# EAGLE design ATiny2PiRM12B-SMD (EAGLE 7.2.0)
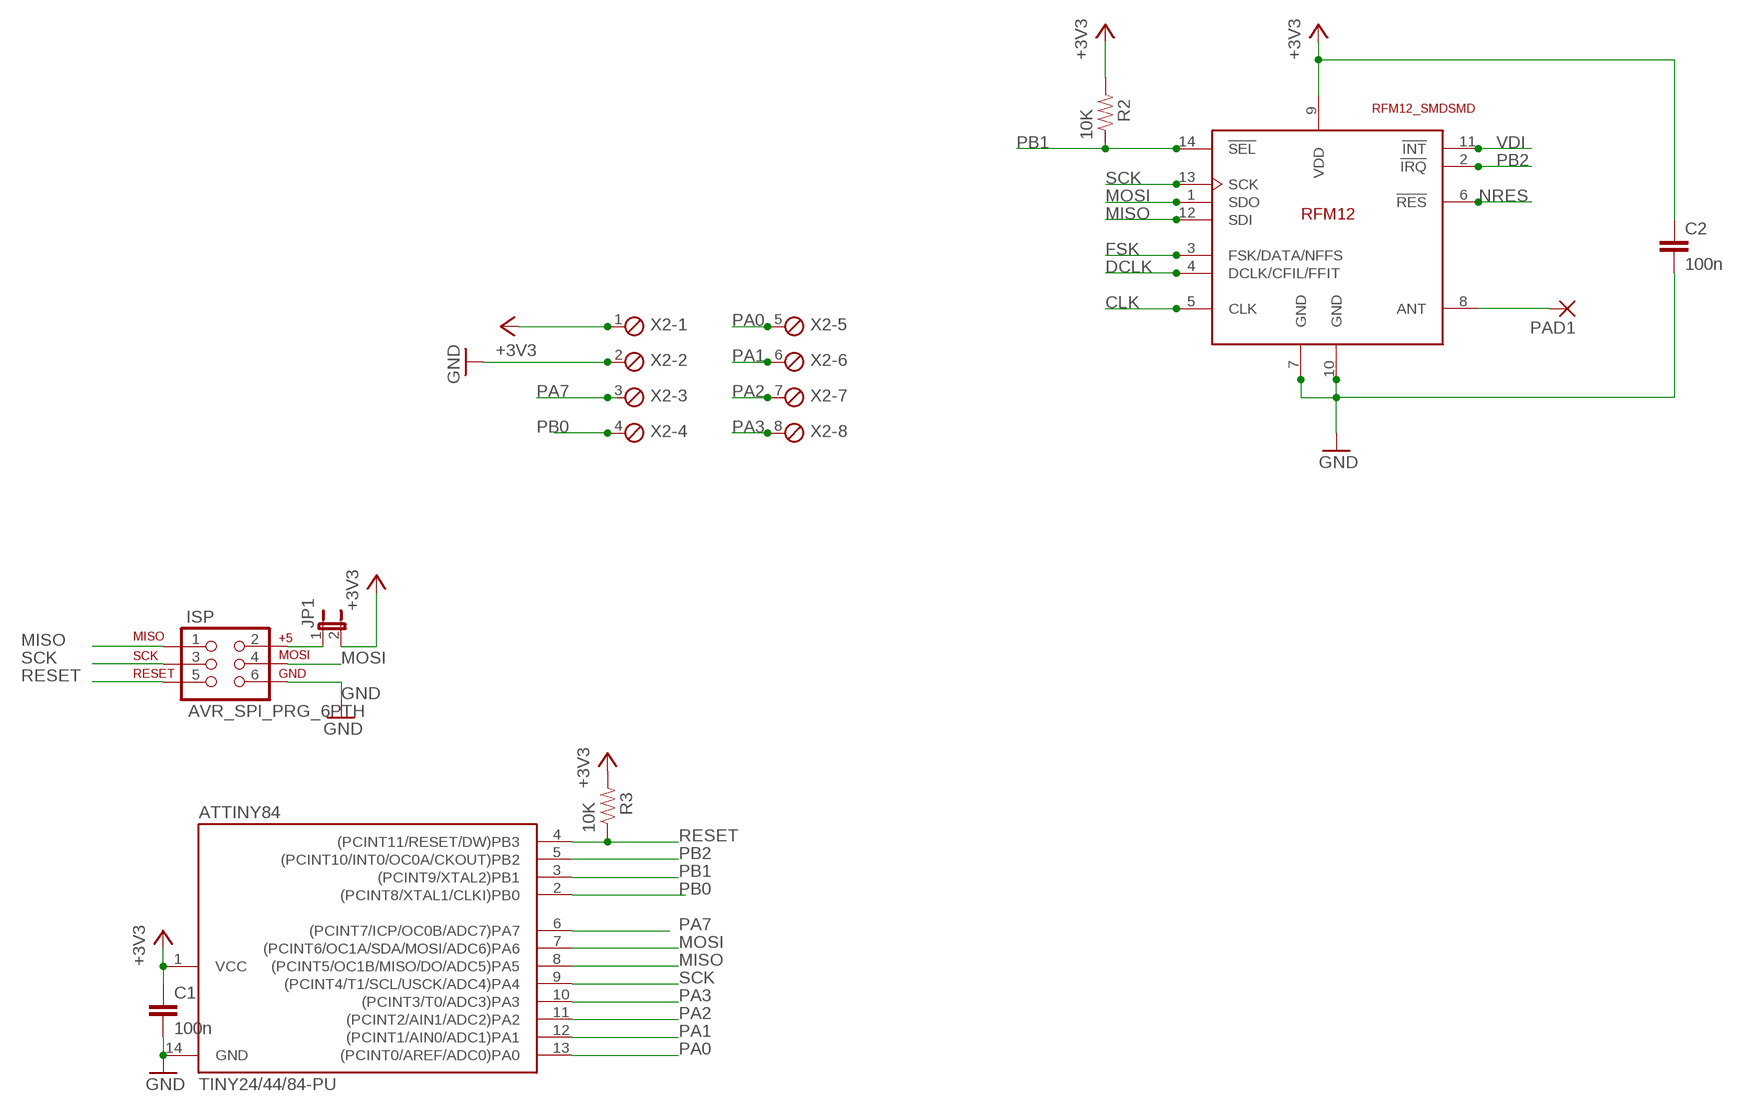
[diagram p0: schematic, sheet 1]

## Parts
ATTINY84  TINY24/44/84-PU  [DIL14]
C1  100n  C-EU025-024X044  [C025-024X044]
C2  100n  C-EU025-024X044  [C025-024X044]
ISP  AVR_SPI_PRG_6PTH  [2X3]
JP1  JUMPER-2PTH  [1X02]
PAD1  1,6/0,8  [1,6/0,8]
R2  10K  RESISTORAXIAL-0.3  [AXIAL-0.3]
R3  10K  RESISTORAXIAL-0.3  [AXIAL-0.3]
U$2  RFM12_SMDSMD  [RFM12]
X2  MPT8  [8POL254]

## Nets
+3V3 [power]: ATTINY84.1(VCC) C1.1 JP1.2 R2.P$2 R3.P$2 X2.1
CLK: U$2.5(CLK)
DCLK: U$2.4(DCLK/CFIL/FFIT)
FSK: U$2.3(FSK/DATA/NFFS)
GND [power]: ATTINY84.14(GND) C1.2 C2.2 ISP.6 U$2.7(GND) U$2.10(GND) X2.2
MISO: ATTINY84.8((PCINT5/OC1B/MISO/DO/ADC5)PA5) ISP.1 U$2.12(SDI)
MOSI: ATTINY84.7((PCINT6/OC1A/SDA/MOSI/ADC6)PA6) ISP.4 U$2.1(SDO)
N$1: ISP.2 JP1.1
N$2: PAD1.1(P) U$2.8(ANT)
NRES: U$2.6(!RES)
PA0: ATTINY84.13((PCINT0/AREF/ADC0)PA0) X2.5
PA1 [power]: ATTINY84.12((PCINT1/AIN0/ADC1)PA1) X2.6
PA2: ATTINY84.11((PCINT2/AIN1/ADC2)PA2) X2.7
PA3: ATTINY84.10((PCINT3/T0/ADC3)PA3) X2.8
PA7: ATTINY84.6((PCINT7/ICP/OC0B/ADC7)PA7) X2.3
PB0: ATTINY84.2((PCINT8/XTAL1/CLKI)PB0) X2.4
PB1: ATTINY84.3((PCINT9/XTAL2)PB1) R2.P$1 U$2.14(!SEL)
PB2: ATTINY84.5((PCINT10/INT0/OC0A/CKOUT)PB2) U$2.2(!IRQ)
RESET: ATTINY84.4((PCINT11/RESET/DW)PB3) ISP.5 R3.P$1
SCK: ATTINY84.9((PCINT4/T1/SCL/USCK/ADC4)PA4) ISP.3 U$2.13(SCK)
VDD [power]: C2.1 U$2.9(VDD) ; supply symbol labelled +3V3
VDI: U$2.11(!INT)

## Library data of the parts
ATTINY84 = avr-7:TINY24/44/84
C1 C2 = rcl:C-EU: CAPACITOR, European symbol
ISP = SparkFun:AVR_SPI_PRG_6: AVR ISP 6 Pin This is the reduced ISP connector for AVR programming. Common on Arduino. This footprint will take up less PCB space and can be used with a 10-pin to 6-pin adapter such as SKU: BOB-08508
JP1 = SparkFun:JUMPER-2: Jumper Basic 0.1" spaced jumper. Use with breakaway headers.
PAD1 = wirepad:1,6/0,8: THROUGH-HOLE PAD
R2 R3 = SparkFun:RESISTOR: Resistor Basic schematic elements and footprints for 0603, 1206, and PTH resistors.
U$2 = rfm_12:RFM12_SMD: RFM12 is a low costing ISM band transceiver module implemented with unique PLL. It works signal ranges from 315/433/868/915MHZ bands, comply with FCC, ETSI regulation. The SPI interface is used to communicate with microcontroller for parameter setting.
X2 = con-phoenix-254:MPT8: PHOENIX CONNECTOR; OC_FARNELL: unknown; OC_NEWARK: unknown

## Net classes
0 default: width 0.254 mm, drill 0.254 mm, clearance 0.254 mm
1 power: width 0.305 mm, drill 0.305 mm, clearance 0.305 mm

## Board
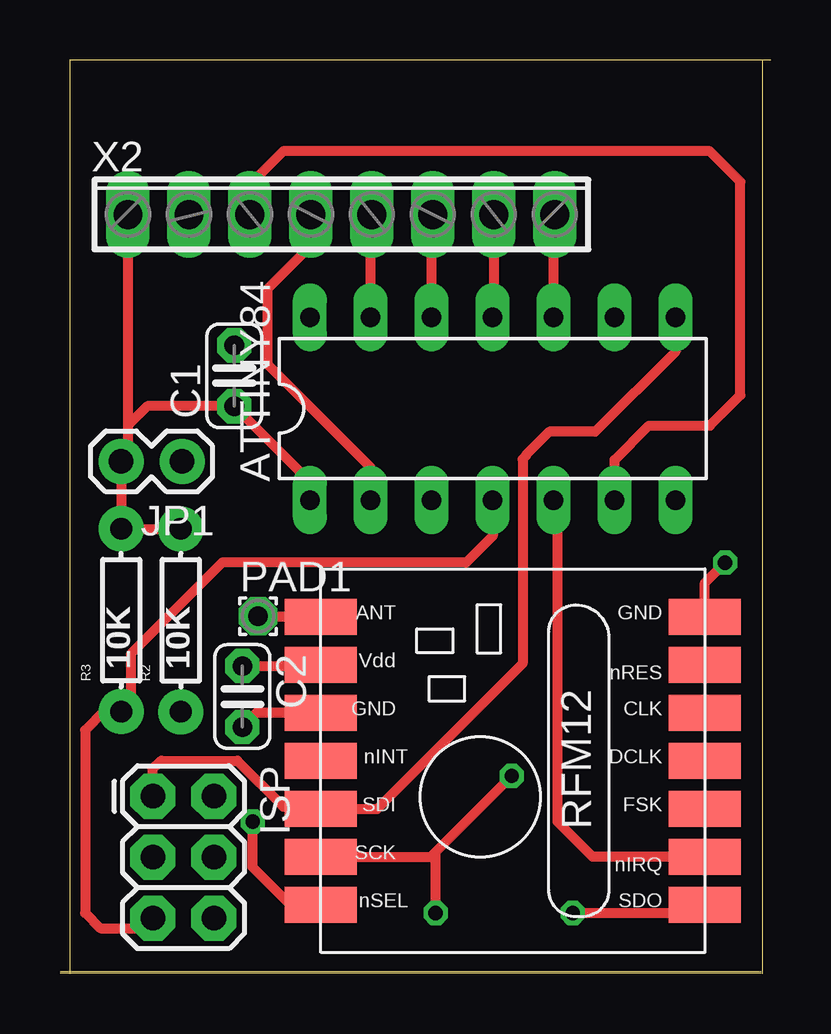
[diagram p1: board, top side]
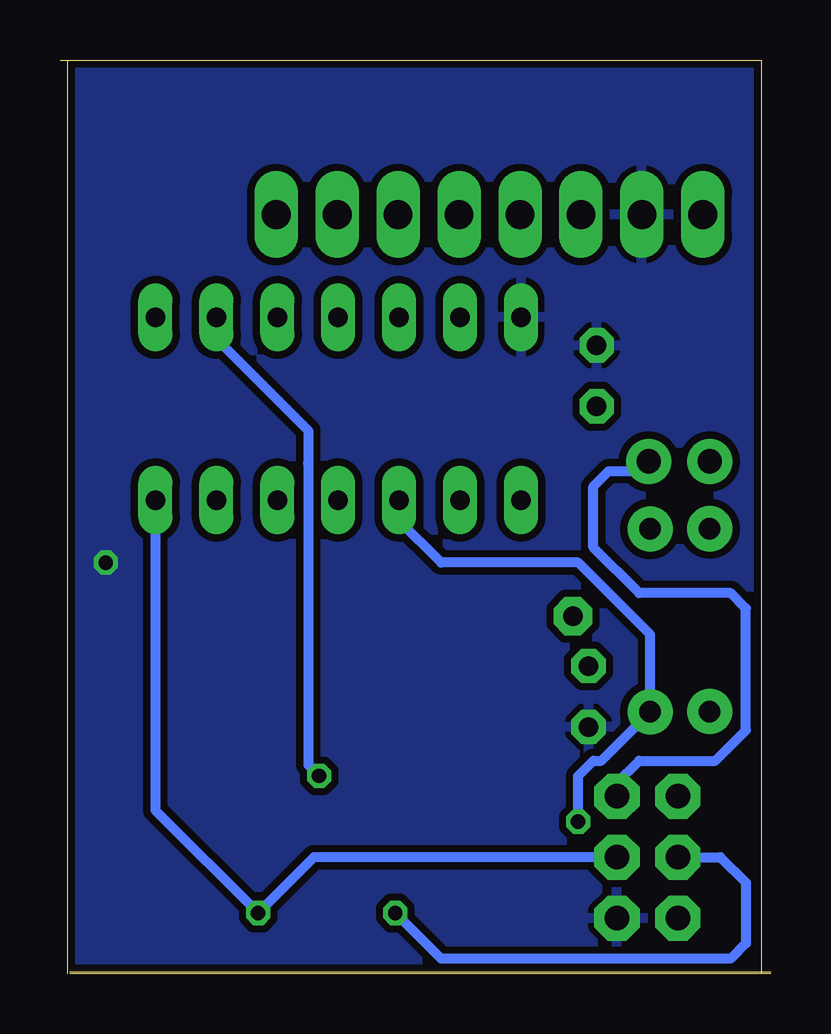
[diagram p2: board, bottom side, seen from below]

Size 29.62 x 38.1 mm. Coordinates in mm from the lower left corner, seen from the top.
Outline: 29.29,0 29.29,38.09
Outline: 0.41,0 0.41,38.1 29.62,38.1
Outline: 29.21,0.1 0,0.1
Outline: 29.21,0.02 0,0.02
Copper layers (1*16): Top 0.035mm / dielectric 1.5mm / Bottom 0.035mm
Design rules "default": minimum track width 12mil, minimum drill 24mil, track to track 12mil, track to pad 12mil, pad to pad 12mil, via to via 14mil, smd to smd 10mil, copper to edge 12mil, drill to drill 8mil, minimum pad ring 12mil, minimum via ring 8mil, stop-mask expansion 4mil, vias tented up to drill 0mil, thermal gap 10mil

### Footprints (pad centres in the part's own frame; a part is rotated, then mirrored left to right if it is on the bottom)
DIL14 = drill 0.813 long: 1 -7.62,-3.81; 2 -5.08,-3.81; 3 -2.54,-3.81; 4 0,-3.81; 5 2.54,-3.81; 6 5.08,-3.81; 7 7.62,-3.81; 8 7.62,3.81; 9 5.08,3.81; 10 2.54,3.81; 11 0,3.81; 12 -2.54,3.81; 13 -5.08,3.81; 14 -7.62,3.81
C025-024X044 = drill 0.813 octagon: 1 -1.27,0; 2 1.27,0
2X3 = drill 1.016 pad 1.88 octagon: 1 0,0; 2 0,2.54; 3 2.54,0; 4 2.54,2.54; 5 5.08,0; 6 5.08,2.54
1X02 = drill 1.016 pad 1.88: 1 0,0; 2 2.54,0
1,6/0,8 = drill 0.813 pad 1.6 octagon: 1 0,0
AXIAL-0.3 = drill 0.9 pad 1.88: P$1 -3.81,0; P$2 3.81,0
RFM12 = smd 1.5 x 3: 1 -5,-10; 2 -3,-10; 3 -1,-10; 4 1,-10; 5 3,-10; 6 5,-10; 7 7,-10; 8 7,6; 9 5,6; 10 3,6; 11 1,6; 12 -1,6; 13 -3,6; 14 -5,6
8POL254 = drill 1.2 long: 1 -8.89,0; 2 -6.35,0; 3 -3.81,0; 4 -1.27,0; 5 1.27,0; 6 3.81,0; 7 6.35,0; 8 8.89,0

### Placement (x,y rotation side)
ATTINY84  18.03,23.57 0 top
C1  7.26,24.93 90 top
C2  7.6,11.57 270 top
ISP  3.87,7.41 270 top
JP1  5.09,21.36 180 top
PAD1  8.25,14.91 0 top
R2  5.03,14.74 90 top
R3  2.55,14.75 90 top
U$2  16.87,7.88 90 top
X2  11.72,31.66 0 top

### Tracks (layer width: path | path; a pad name or v marks a point on that pad's centre or on a via)
+3V3
  Top 0.406: ATTINY84.1 10.01,19.76 10.01,20.92 C1.1 3.64,23.66 2.83,22.86 | 5.17,18.41 R2.P$2 R3.P$2 JP1.2 2.83,21.65 2.83,22.86 | X2.1 2.83,22.86
GND  (via drill 0.6)
  Top 0.406: U$2.10 8.18,10.88 C2.2 | U$2.7 26.87,16.3 v27.71,17.14
  pour Bottom: 0.41,38.1 29.62,38.1 29.62,0 0.41,0
MISO
  Top 0.406: ISP.1 3.87,8.54 4.22,8.89 7.39,8.89 9.3,6.99 10.77,6.99 U$2.12 10.89,6.86 13.2,6.86 19.27,12.94 19.27,21.45 19.41,21.59 19.41,21.62 20.4,22.6 22.3,22.6 25.65,25.95 ATTINY84.8
MOSI  (via drill 0.6)
  Top 0.406: v21.36,2.54 26.53,2.54 U$2.1
  Bottom 0.406: ISP.4 19.04,4.87 v21.36,2.54 25.65,6.82 ATTINY84.7
N$1
  Bottom 0.406: ISP.2 6.41,7.97 5.49,8.89 2.31,8.89 1.04,10.16 1.04,15.24 1.68,15.88 5.49,15.88 7.39,17.78 7.39,20.32 6.76,20.95 5.5,20.95 JP1.1
N$2
  Top 0.406: PAD1.1 10.84,14.91 U$2.8
PA0
  Top 0.406: ATTINY84.13 12.95,31.61 X2.5
PA1
  Top 0.406: ATTINY84.12 15.49,31.61 X2.6
PA2
  Top 0.406: X2.7 18.07,27.42 ATTINY84.11
PA3
  Top 0.406: ATTINY84.10 20.57,31.61 X2.8
PA7
  Top 0.406: ATTINY84.6 23.11,21.43 24.54,22.86 27.08,22.86 28.35,24.13 28.35,33.02 27.08,34.29 9.3,34.29 8.03,33.02 8.03,31.77 X2.3
PB0
  Top 0.406: ATTINY84.2 12.95,21.12 8.66,25.4 8.66,28.57 10.57,30.48 10.57,31.54 X2.4
PB1  (via drill 0.6)
  Top 0.406: U$2.14 9.59,2.88 8.03,4.45 v8.03,6.35
  Bottom 0.406: ATTINY84.3 15.49,18.89 13.74,17.14 8.03,17.14 5.03,14.15 R2.P$1 7.07,8.89 7.39,8.89 8.03,8.26 v8.03,6.35
PB2
  Top 0.406: U$2.2 22.2,4.88 20.73,6.35 20.73,19.59 ATTINY84.5
RESET
  Top 0.406: ISP.5 3.45,1.91 1.68,1.91 1.04,2.54 1.04,10.16 1.82,10.94 R3.P$1 2.95,11.34 2.95,13.34 6.76,17.14 16.92,17.14 18.03,18.25 ATTINY84.4
SCK  (via drill 0.6)
  Top 0.406: U$2.13 15.45,4.88 15.65,5.08 | 15.65,5.08 v18.82,8.26 | v15.65,2.54 15.65,5.08
  Bottom 0.406: ATTINY84.9 23.11,26.49 19.28,22.66 19.28,21.29 19.27,21.29 19.27,8.71 v18.82,8.26 | ISP.3 2.1,4.87 1.04,3.81 1.04,1.27 1.68,0.64 13.74,0.64 v15.65,2.54
VDD
  Top 0.406: C2.1 10.82,12.84 U$2.9